# Altium schematic sheet ftdi.SchDoc
size A4; SheetNumber: 4; SheetTotal: 4
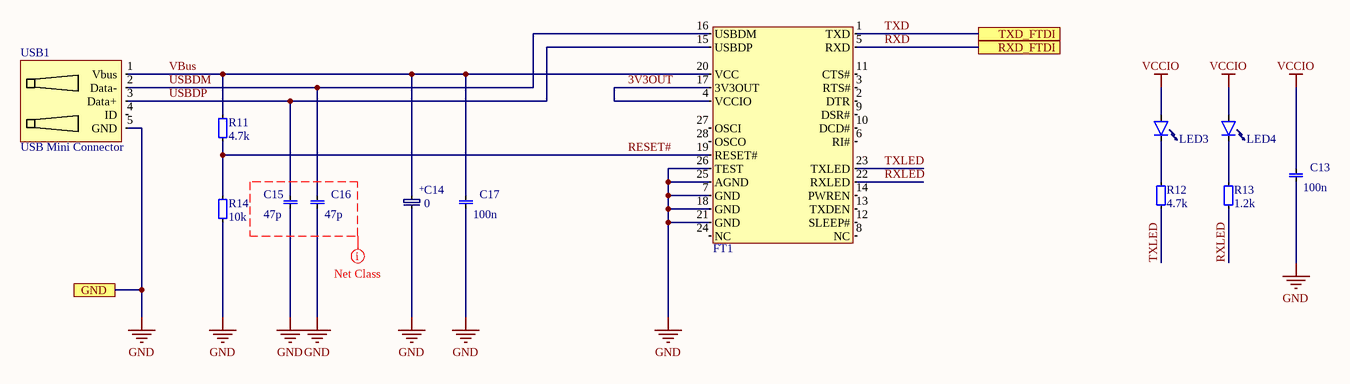
[diagram p0: ftdi.SchDoc]

## Parts
C13  value 100n  [0603 cap]  (hidden comment: 0603, capacitor)
C14  value 0  [CASE_B]  (hidden comment: Cap, case B)
C15  value 47p  [0603 cap]  (hidden comment: 0603, capacitor)
C16  value 47p  [0603 cap]  (hidden comment: 0603, capacitor)
C17  value 100n  [0603 cap]  (hidden comment: 0603, capacitor)
FT1  FT232R  [SOP28]  (value not drawn)
LED3  0805, LED  [0805_led]  (value not drawn)
LED4  0805, LED  [0805_led]  (value not drawn)
R11  value 4.7k  [0603]  (hidden comment: 0603, resistor)
R12  value 4.7k  [0603]  (hidden comment: 0603, resistor)
R13  value 1.2k  [0603]  (hidden comment: 0603, resistor)
R14  value 10k  [0603]  (hidden comment: 0603, resistor)
USB1  USB Mini Connector  [USB Mini TH]

## Ports
GND (see meltdown_hardware[4A]), RXD_FTDI (see meltdown_hardware[4A]), TXD_FTDI (see meltdown_hardware[4A])

## Nets
GND: C13.0 C14.1 C15.0 C16.0 C17.0 FT1.7(GND) FT1.18(GND) FT1.21(GND) FT1.25(AGND) FT1.26(TEST) R14.1 USB1.5(GND) ; port GND
VCCIO: C13.1 LED3.1 LED4.1
3V3OUT: FT1.4(VCCIO) FT1.17(3V3OUT)
RESET#: FT1.19(RESET#) R11.1 R14.0
RXD: FT1.5(RXD) ; port RXD_FTDI
RXLED: FT1.22(RXLED) R13.1
TXD: FT1.1(TXD) ; port TXD_FTDI
TXLED: FT1.23(TXLED) R12.1
USBDM: C16.1 FT1.16(USBDM) USB1.2(Data-)
USBDP: C15.1 FT1.15(USBDP) USB1.3(Data+)
VBus: C14.2 C17.1 FT1.20(VCC) R11.0 USB1.1(Vbus)
NetLED3_0: LED3.0(Cathode) R12.0
NetLED4_0: LED4.0(Cathode) R13.0

Not connected (* = marked no-connect by the designer): FT1 2(DTR) 3(RTS#) 6(RI#) 8(NC) 9(DSR#) 10(DCD#) 11(CTS#) 12(SLEEP#) 13(TXDEN) 14(PWREN) 24(NC) 27(OSCI) 28(OSCO); USB1 4(ID)

## Layout directives
net class Small stuff: (no net found under the mark)

## Notes on the sheet
- (in symbol Cap, case B) +

## Library data of the parts
FT1 = FT232R: USB UART IC; Value: FT232R; DigiKey: 768-1007-1-ND; Farnell: 1146032
LED3 LED4 = 0805, LED: Value: 0805 LED
C13 C15-C17 = 0603, capacitor: Order number: *
USB1 = USB Mini Connector: Value: USB Mini Connector; Farnell: 1125348